# Altium schematic sheet Main.SchDoc
size A4; SheetNumber: 1; SheetTotal: 6
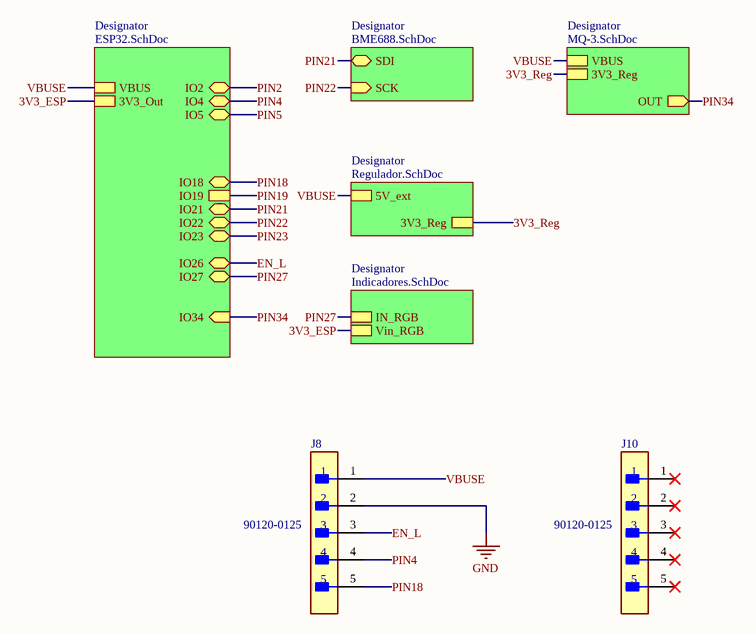
[diagram p0: Main.SchDoc]

## Parts
J8  90120-0125  [FP-90120-0125-MFG]
J10  90120-0125  [FP-90120-0125-MFG]

## Sub-sheets
Designator = ESP32.SchDoc: IO18 (bidir), IO21 (bidir), IO22 (bidir), IO23 (bidir), IO27 (bidir), IO34 (in), VBUS, 3V3_Out, IO2 (bidir), IO4 (bidir), IO5 (bidir), IO19, IO26 (bidir)
Designator = MQ-3.SchDoc: OUT (out), 3V3_Reg, VBUS
Designator = Regulador.SchDoc: 3V3_Reg, 5V_ext
Designator = BME688.SchDoc: SDI (bidir), SCK (in)
Designator = Indicadores.SchDoc: IN_RGB, Vin_RGB

## Nets
GND: J8.2
3V3_ESP: sheet Designator/3V3_Out, sheet Designator/Vin_RGB
3V3_Reg: sheet Designator/3V3_Reg, sheet Designator/3V3_Reg
EN_L: J8.3 ; sheet Designator/IO26
PIN2: sheet Designator/IO2
PIN4: J8.4 ; sheet Designator/IO4
PIN5: sheet Designator/IO5
PIN18: J8.5 ; sheet Designator/IO18
PIN19: sheet Designator/IO19
PIN21: sheet Designator/IO21, sheet Designator/SDI
PIN22: sheet Designator/IO22, sheet Designator/SCK
PIN23: sheet Designator/IO23
PIN27: sheet Designator/IO27, sheet Designator/IN_RGB
PIN34: sheet Designator/IO34, sheet Designator/OUT
VBUSE: J8.1 ; sheet Designator/VBUS, sheet Designator/VBUS, sheet Designator/5V_ext

Not connected (* = marked no-connect by the designer): J10 1* 2* 3* 4* 5*

## Library data of the parts
J8 J10 = CMP-00257-00655425-1: 90120-0125 2.54mm Pitch C-Grid III Header, Single Row, Vertical, 5 Circuits, Tin (Sn) Plating; NexarPartId: 655425; Manufacturer Lifecycle Status: ACTIVE; Lead Length: 2.9mm; Number of Positions: 5; Current Rating: 3A; Mating Post Length: 6.75mm; Glow Wire Compliant: Non-compliant; Contact Resistance: 20mΩ; Voltage Rating: 350V; Gender: Male; Max Voltage Rating (DC): 350.35kV; Max Operating Temperature: 125°C; Number of Pins: 5; Plating: Tin; Contact Material: Brass; Mount: Through Hole; Contact Gender: Male; Packaging: Bulk; Schedule B: 8536694040; Lifecycle Status: Production; Lead Pitch: 2.54mm; Radiation Hardening: No; Orientation: Vertical; Min Operating Temperature: -55°C; Country of Origin: SK; Housing Color: Black; REACH SVHC: No SVHC; Contact Plating: Tin; Number of Rows: 1; Number of Circuits: 5; Termination: Solder; Number of Contacts: 5; Pitch: 2.54mm; Housing Material: Polyester; RoHS: Compliant; Lead Free: Lead Free; Voltage Rating (AC): 350V